# Altium schematic sheet 1_mb_conn.SchDoc: MB connector
size A4; SheetNumber: 1; SheetTotal: 2
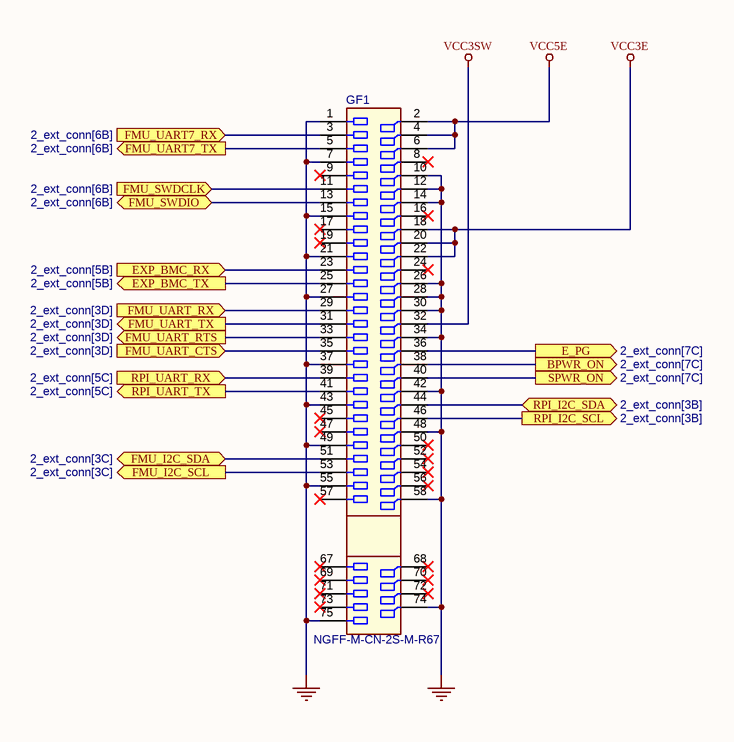
[diagram p0: 1_mb_conn.SchDoc]

## Parts
GF1  NGFF-M-CN-2S-M-R67  [NGFF-M-GF-2D-500-1K-S67]  (no BOM)

## Ports
BPWR_ON (out, see 2_ext_conn[7C]), E_PG (out, see 2_ext_conn[7C]), EXP_BMC_RX (in, see 2_ext_conn[5B]), EXP_BMC_TX (out, see 2_ext_conn[5B]), FMU_I2C_SCL (out, see 2_ext_conn[3C]), FMU_I2C_SDA (bidir, see 2_ext_conn[3C]), FMU_SWDCLK (in, see 2_ext_conn[6B]), FMU_SWDIO (bidir, see 2_ext_conn[6B]), FMU_UART7_RX (in, see 2_ext_conn[6B]), FMU_UART7_TX (out, see 2_ext_conn[6B]), FMU_UART_CTS (in, see 2_ext_conn[3D]), FMU_UART_RTS (out, see 2_ext_conn[3D]), FMU_UART_RX (in, see 2_ext_conn[3D]), FMU_UART_TX (out, see 2_ext_conn[3D]), RPI_I2C_SCL (out, see 2_ext_conn[3B]), RPI_I2C_SDA (bidir, see 2_ext_conn[3B]), RPI_UART_RX (in, see 2_ext_conn[5C]), RPI_UART_TX (out, see 2_ext_conn[5C]), SPWR_ON (out, see 2_ext_conn[7C])

## Nets
GND: GF1.1 GF1.7 GF1.10 GF1.12 GF1.14 GF1.15 GF1.21 GF1.26 GF1.27 GF1.28 GF1.30 GF1.34 GF1.37 GF1.42 GF1.43 GF1.48 GF1.49 GF1.55 GF1.58 GF1.74 GF1.75
VCC3E: GF1.18 GF1.20 GF1.22
VCC3SW: GF1.32
VCC5E: GF1.2 GF1.4 GF1.6
BPWR_ON: GF1.38 ; port BPWR_ON
E_PG: GF1.36 ; port E_PG
EXP_BMC_RX: GF1.23 ; port EXP_BMC_RX
EXP_BMC_TX: GF1.25 ; port EXP_BMC_TX
FMU_I2C_SCL: GF1.53 ; port FMU_I2C_SCL
FMU_I2C_SDA: GF1.51 ; port FMU_I2C_SDA
FMU_SWDCLK: GF1.11 ; port FMU_SWDCLK
FMU_SWDIO: GF1.13 ; port FMU_SWDIO
FMU_UART7_RX: GF1.3 ; port FMU_UART7_RX
FMU_UART7_TX: GF1.5 ; port FMU_UART7_TX
FMU_UART_CTS: GF1.35 ; port FMU_UART_CTS
FMU_UART_RTS: GF1.33 ; port FMU_UART_RTS
FMU_UART_RX: GF1.29 ; port FMU_UART_RX
FMU_UART_TX: GF1.31 ; port FMU_UART_TX
RPI_I2C_SCL: GF1.46 ; port RPI_I2C_SCL
RPI_I2C_SDA: GF1.44 ; port RPI_I2C_SDA
RPI_UART_RX: GF1.39 ; port RPI_UART_RX
RPI_UART_TX: GF1.41 ; port RPI_UART_TX
SPWR_ON: GF1.40 ; port SPWR_ON

Not connected (* = marked no-connect by the designer): GF1 8* 9* 16* 17* 19* 24* 45* 47* 50* 52* 54* 56* 57* 67* 68* 69* 70* 71* 72* 73*

## Notes on the sheet
- Title
- Size:
- Date:
- A4
- Number:
- Time:
- Revision:
- Sheet
- of
- File:

## Library data of the parts
GF1 = CMP-002-00069-1: Golden finger, NGFF key M, Dual, Staggered, Pitch 0.5mm, 67-Position; System: Connector; Pins: 67